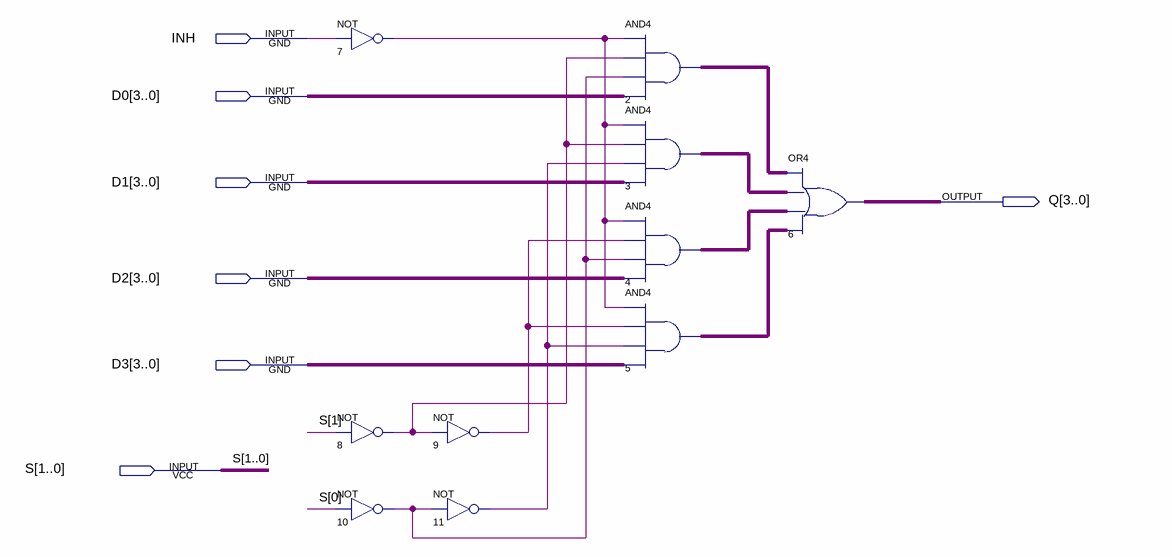
[diagram p0: schematic sheet]
// Quartus schematic MUX41Bus.bdf as structural Verilog: 10 symbols, 7 pins
module MUX41Bus (
  input  INH,
  input  [3:0] D0,
  input  [3:0] D1,
  input  [3:0] D2,
  input  [3:0] D3,
  input  [1:0] S,
  output [3:0] Q
);

  wire n7_out, n8_out, n9_out, n10_out, n11_out;
  wire [3:0] n2_out, n3_out, n4_out, n5_out;

  not u_7 (n7_out, INH);
  not u_8 (n8_out, S[1]);
  not u_10 (n10_out, S[0]);
  not u_9 (n9_out, n8_out);
  not u_11 (n11_out, n10_out);
  assign n2_out = {4{n7_out}} & {4{n8_out}} & {4{n10_out}} & D0;  // AND4 2, 4 bits wide
  assign n3_out = {4{n7_out}} & {4{n8_out}} & {4{n11_out}} & D1;  // AND4 3, 4 bits wide
  assign n4_out = {4{n7_out}} & {4{n9_out}} & {4{n10_out}} & D2;  // AND4 4, 4 bits wide
  assign n5_out = {4{n7_out}} & {4{n9_out}} & {4{n11_out}} & D3;  // AND4 5, 4 bits wide
  assign Q = n2_out | n3_out | n4_out | n5_out;  // OR4 6, 4 bits wide
endmodule
